# Altium project Pixhawk Power Distributor.PrjPcb
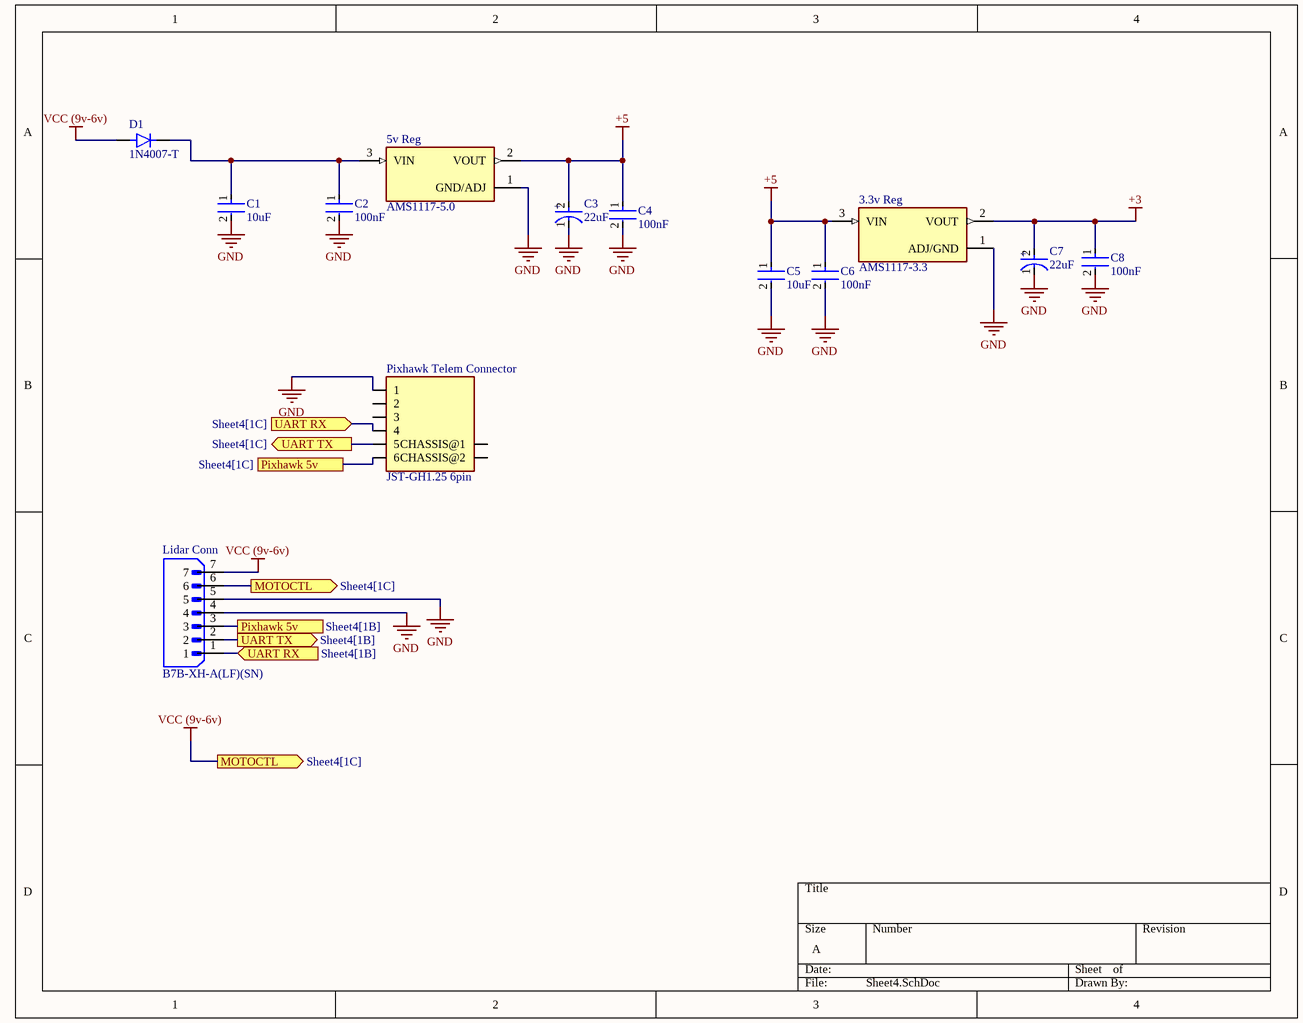
[diagram p0: Sheet4.SchDoc]
1 sheet, 13 parts. Net scope: flat (ports and power ports of the same name join across sheets).
Board file: PCB2.PcbDoc

## Sheet Sheet4.SchDoc
size A; SheetNumber: 1; SheetTotal: 1

### Parts
3.3v_Reg  AMS1117-3.3  [SOT229P700X180-4N]
5v_Reg  AMS1117-5.0  [SOT229P700X180-4N]
C1  10uF  [FP-GRM31C-0_2-e0_3_0_8-MFG]
C2  100nF  [FP-CGA3E-0_3-0_1-IPC_A]
C3  22uF  [FP-T491B226K016AT-MFG]
C4  100nF  [FP-CGA3E-0_3-0_1-IPC_A]
C5  10uF  [FP-GRM31C-0_2-e0_3_0_8-MFG]
C6  100nF  [FP-CGA3E-0_3-0_1-IPC_A]
C7  22uF  [FP-T491B226K016AT-MFG]
C8  100nF  [FP-CGA3E-0_3-0_1-IPC_A]
D1  1N4007-T  [DIOAD780W78L463D236]
Lidar_Conn  B7B-XH-A(LF)(SN)  [JST_B7B-XH-A(LF)(SN)]
Pixhawk_Telem_Connector  JST-GH1.25 6pin  [BM06B-GHS-TBT]

### Ports
MOTOCTL (out, see Sheet4[1C]), Pixhawk 5v (see Sheet4[1B]), Pixhawk 5v (see Sheet4[1C]), UART RX (in, see Sheet4[1B]), UART RX (in, see Sheet4[1C]), UART TX (out, see Sheet4[1B]), UART TX (out, see Sheet4[1C])

### Nets
+3: 3.3v_Reg.2(VOUT) C7.2(A) C8.1
+5: 3.3v_Reg.3(VIN) 5v_Reg.2(VOUT) C3.2(A) C4.1 C5.1 C6.1
GND: 3.3v_Reg.1(ADJ/GND) 5v_Reg.1(GND/ADJ) C1.2 C2.2 C3.1(C) C4.2 C5.2 C6.2 C7.1(C) C8.2 Lidar_Conn.4 Lidar_Conn.5 Pixhawk_Telem_Connector.1
VCC (9v-6v): D1.A Lidar_Conn.6 Lidar_Conn.7 ; port MOTOCTL
Net5v_Reg_3: 5v_Reg.3(VIN) C1.1 C2.1 D1.K
NetLidar_Conn_1: Lidar_Conn.1 Pixhawk_Telem_Connector.4 ; port UART RX
NetLidar_Conn_2: Lidar_Conn.2 Pixhawk_Telem_Connector.5 ; port UART TX
NetLidar_Conn_3: Lidar_Conn.3 Pixhawk_Telem_Connector.6 ; port Pixhawk 5v

Not connected (* = marked no-connect by the designer): Pixhawk_Telem_Connector 2 3 13(CHASSIS@1) 14(CHASSIS@2)

### Notes on the sheet
- (in symbol CMP-03017-000029-1) +

### Library data of the parts
3.3v_Reg = AMS1117-3.3: Linear Voltage Regulator IC Positive Fixed 1 Output 1A SOT-223-3L; MF: UMW; SnapEDA_Link: https://www.snapeda.com/parts/AMS1117-3.3/UMW/view-part/?ref=snap; Package: SOT-223-3L UMW; Value: *; MP: AMS1117-3.3; Check_prices: https://www.snapeda.com/parts/AMS1117-3.3/UMW/view-part/?ref=eda
5v_Reg = AMS1117-5.0: 1A LOW DROPOUT VOLTAGE REGULATOR; MF: ams; MP: AMS1117-5.0; Package: SOT-223 Seeed Technology; SnapEDA_Link: https://www.snapeda.com/parts/AMS1117-5.0/ams/view-part/?ref=snap; Check_prices: https://www.snapeda.com/parts/AMS1117-5.0/ams/view-part/?ref=eda; Availability: Not in stock; Value: *; Price: None
C1 C5 = CMP-06035-005515-1: Chip Multilayer Ceramic Capacitors for General Purpose, 1206, 10uF, X7R, 15%, 10%, 25V; Dielectric: X7R; Max Operating Temperature: 125°C; Capacitance: 10uF; Voltage Rating (DC): 25V; Case/Package: 1206; Thickness: 0.071inch; Tolerance: 10%; Voltage Rating: 25V; Mount: Surface Mount; Width: 0.063inch; Length: 0.126inch; Min Operating Temperature: -55°C; Packaging: Tape and Reel; Lead Free: Lead Free; Voltage: 25V
C2 C4 C6 C8 = CMP-2000-07546-2: Cap Ceramic 100nF 50V X7R 10% Pad SMD 0603 +125°C Automotive T/R; Weight: 7.1E-05oz; Composition: Ceramic; Max Operating Temperature: 125°C; Termination: SMD/SMT; Dielectric: X7R; Length: 1.6mm; Package Quantity: 1; REACH SVHC: No SVHC; Lead Free: Lead Free; Case Code (Metric): 1608; Min Operating Temperature: -55°C; Packaging: Tape and Reel; Tolerance: 10%; Voltage Rating: 50V; Case Code (Imperial): 0603; Capacitance: 100nF; Case/Package: 0603; Voltage Rating (DC): 50V; Depth: 0.8mm; Radiation Hardening: No; Ratings: AEC-Q200; Mount: Surface Mount; Voltage: 50V; Thickness: 0.035inch; Width: 0.8mm; Height: 0.8mm
C3 C7 = CMP-03017-000029-1: CAP TANT 22UF 10% 16V 1411; Polarity: Polar; Dissipation Factor: 6%; Dielectric Material: Tantalum; ESR (Equivalent Series Resistance): 2.2R; Life (Hours): 2000Hour; Leakage Current: 3.6uA; Radiation Hardening: No; Min Operating Temperature: -55°C; Packaging: Tape and Reel; Tolerance: 10%; Case Code (Imperial): 1411; Package Quantity: 1; Width: 2.8mm; Termination: SMD/SMT; Lead Free: Lead Free; Features: General Purpose; Capacitance: 22uF; Case/Package: 1411; Mount: Surface Mount; Voltage Rating (DC): 16V; Depth: 2.8mm; Height - Seated (Max): 0.083inch; Voltage Rating: 16V; Number of Pins: 2; Lead Pitch: 1.9mm; RoHS Compliant: Yes; Failure Rate: 0.001%; Height: 1.9mm; Voltage: 16V; Case Code (Metric): 3528; Max Operating Temperature: 125°C; Length: 3.5mm; Weight: 0.002293oz; REACH SVHC: No SVHC
D1 = 1N4007-T: MF: {'manufacturer': u'Diodes Incorporated'}; Package: None; Price: None; Value: *; MP: 1N4007-T; Availability: Unavailable
Lidar_Conn = B7B-XH-A(LF)(SN): Connector Header Through Hole 7 position 0.098 (2.50mm); MF: JST Sales America Inc.; SnapEDA_Link: https://www.snapeda.com/parts/B7B-XH-A(LF)(SN)/JST/view-part/?ref=snap; Package: None; Value: *; MP: B7B-XH-A(LF)(SN); Check_prices: https://www.snapeda.com/parts/B7B-XH-A(LF)(SN)/JST/view-part/?ref=eda
Pixhawk_Telem_Connector = BM06B-GHS-TBT: Connector Header Surface Mount 6 position 0.049" (1.25mm); MF: JST Sales; Package: None; Price: None; Value: *; SnapEDA_Link: https://www.snapeda.com/parts/BM06B-GHS-TBT/JST/view-part/?ref=snap; MP: BM06B-GHS-TBT; Availability: Unavailable; Check_prices: https://www.snapeda.com/parts/BM06B-GHS-TBT/JST/view-part/?ref=eda